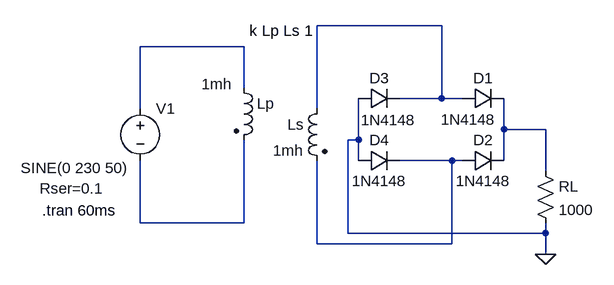
[diagram p0: schematic Full_Wave_Bridge_Rectifier_LTSPICE.asc]
Full_Wave_Bridge_Rectifier_LTSPICE.asc, the LTspice schematic file:
Version 4
SHEET 1 880 680
WIRE 336 -32 144 -32
WIRE 32 0 -128 0
WIRE 32 64 32 0
WIRE 336 80 336 -32
WIRE 336 80 272 80
WIRE 368 80 336 80
WIRE -128 96 -128 0
WIRE 144 96 144 -32
WIRE 432 128 432 80
WIRE 496 128 432 128
WIRE 208 144 208 80
WIRE 208 144 192 144
WIRE 208 176 208 144
WIRE 352 176 272 176
WIRE 368 176 352 176
WIRE 432 176 432 128
WIRE 496 192 496 128
WIRE -128 272 -128 176
WIRE 32 272 32 144
WIRE 32 272 -128 272
WIRE 192 288 192 144
WIRE 496 288 496 272
WIRE 496 288 192 288
WIRE 144 304 144 176
WIRE 352 304 352 176
WIRE 352 304 144 304
WIRE 496 320 496 288
FLAG 496 320 0
SYMBOL diode 208 96 R270
WINDOW 0 32 32 VTop 2
WINDOW 3 -2 46 VBottom 2
SYMATTR InstName D3
SYMATTR Value 1N4148
SYMBOL diode 368 96 R270
WINDOW 0 32 32 VTop 2
WINDOW 3 -1 9 VBottom 2
SYMATTR InstName D1
SYMATTR Value 1N4148
SYMBOL diode 208 192 R270
WINDOW 0 32 32 VTop 2
WINDOW 3 0 32 VBottom 2
SYMATTR InstName D4
SYMATTR Value 1N4148
SYMBOL diode 368 192 R270
WINDOW 0 32 32 VTop 2
WINDOW 3 0 32 VBottom 2
SYMATTR InstName D2
SYMATTR Value 1N4148
SYMBOL ind2 16 48 R0
WINDOW 3 -50 10 Left 2
SYMATTR InstName Lp
SYMATTR Value 1mh
SYMATTR Type ind
SYMBOL ind2 160 80 M0
SYMATTR InstName Ls
SYMATTR Value 1mh
SYMATTR Type ind
SYMBOL voltage -128 80 R0
WINDOW 123 0 0 Left 0
WINDOW 39 -155 139 Left 2
WINDOW 3 -184 107 Left 2
SYMATTR SpiceLine Rser=0.1
SYMATTR InstName V1
SYMATTR Value SINE(0 230 50)
SYMBOL res 480 176 R0
SYMATTR InstName RL
SYMATTR Value 1000
TEXT 40 -24 Left 2 !k Lp Ls 1
TEXT -279 253 Left 2 !.tran 60ms

The netlist it stands for:
* Full_Wave_Bridge_Rectifier_LTSPICE.asc
D3 0 N001 1N4148
D1 N001 N003 1N4148
D4 0 N004 1N4148
D2 N004 N003 1N4148
Lp N002 N005 1mh
Ls N001 N004 1mh
V1 N002 N005 SINE(0 230 50) Rser=0.1
RL N003 0 1000
.model D D
.lib standard.dio
k Lp Ls 1
.tran 60ms
.backanno
.end